# EAGLE design ROMmulti_final_rev01 (EAGLE 9.6.2)
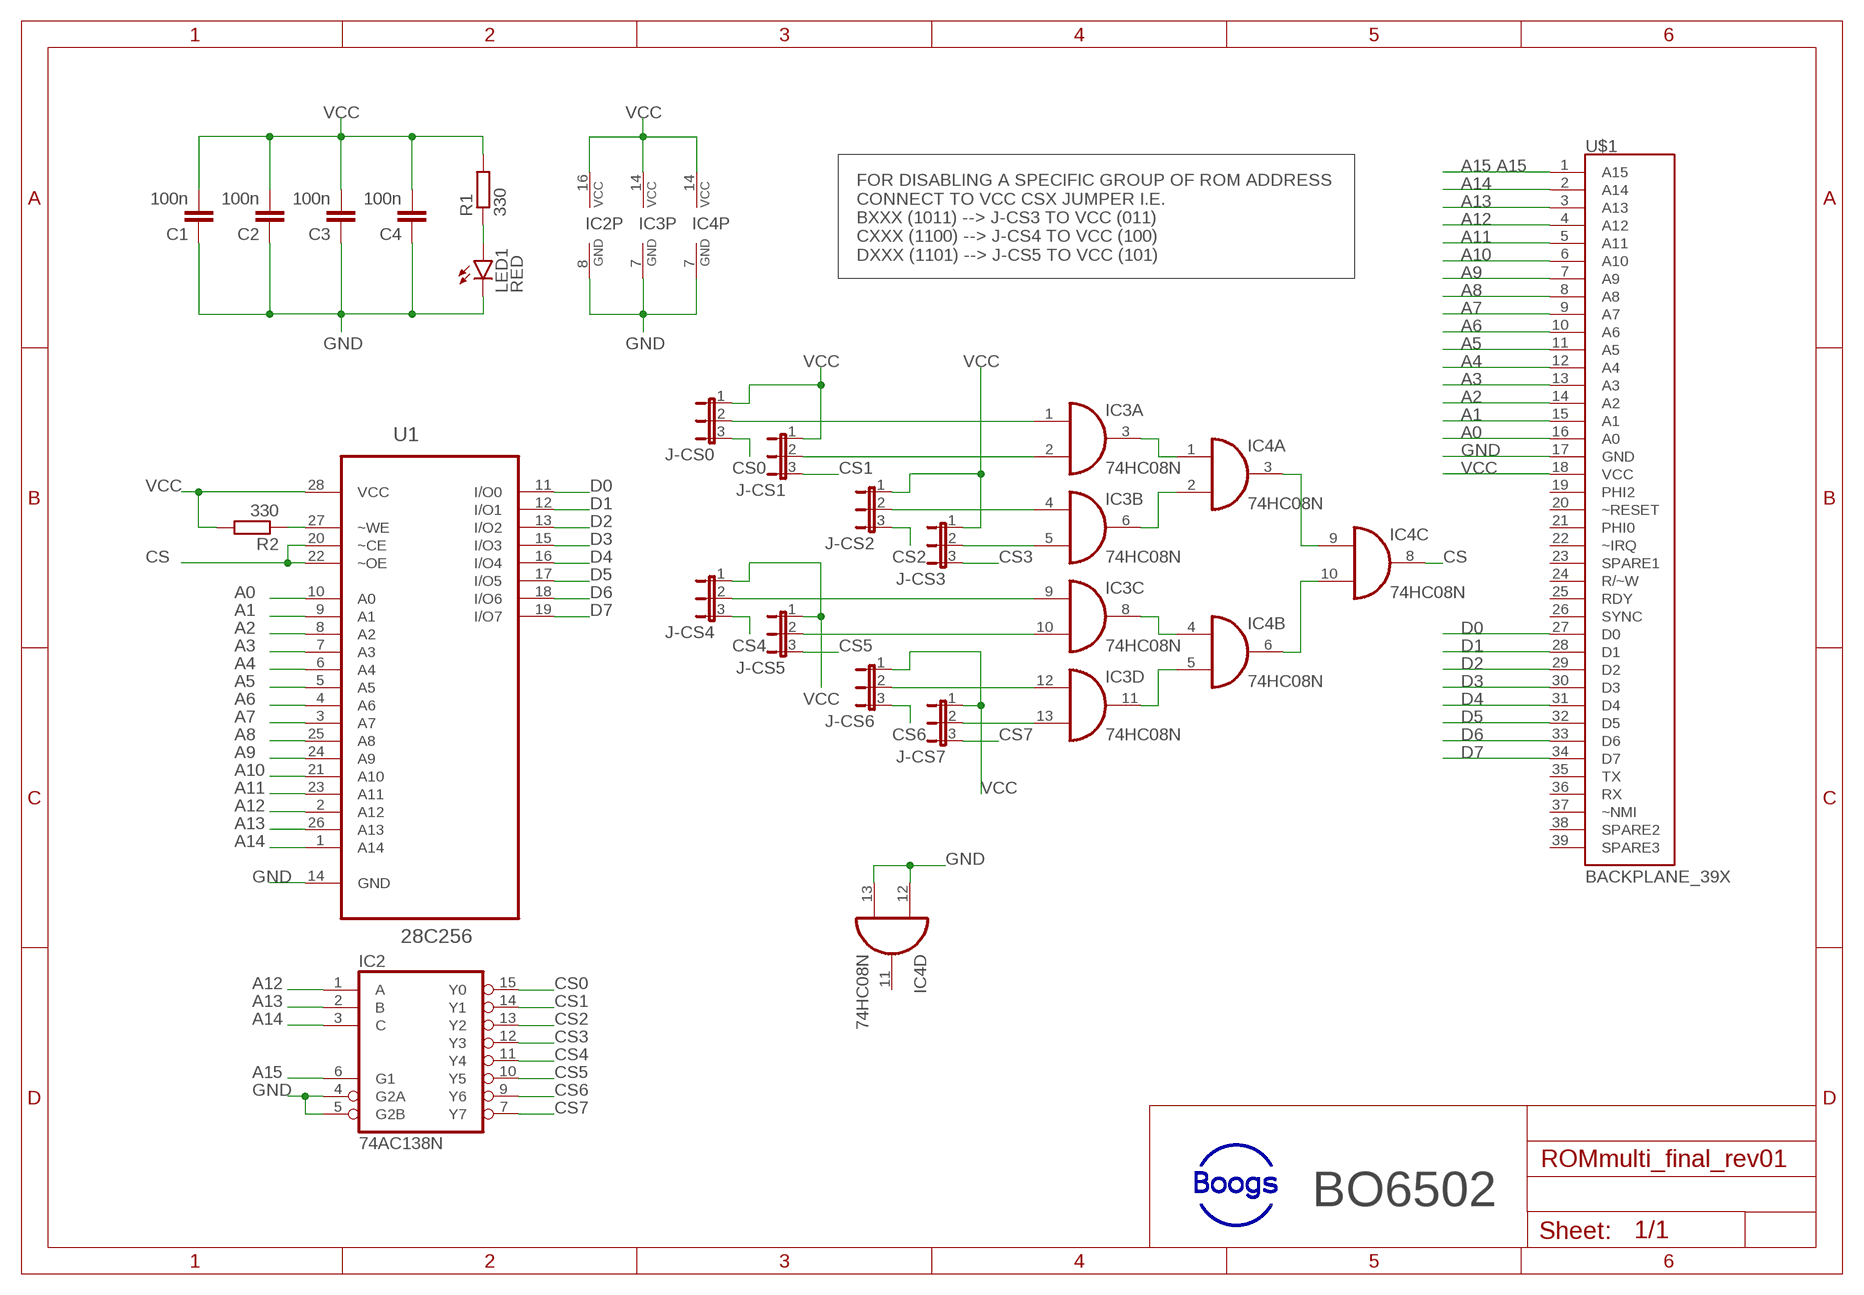
[diagram p0: schematic, sheet 1]

## Parts
C1  100n  C-EU025-025X050  [C025-025X050]
C2  100n  C-EU025-025X050  [C025-025X050]
C3  100n  C-EU025-025X050  [C025-025X050]
C4  100n  C-EU025-025X050  [C025-025X050]
IC2  74AC138N  [DIL16]
IC3  74HC08N  [DIL14]
IC4  74HC08N  [DIL14]
J-CS0  J-CS0  JP2E  [JP2]
J-CS1  J-CS1  JP2E  [JP2]
J-CS2  J-CS2  JP2E  [JP2]
J-CS3  J-CS3  JP2E  [JP2]
J-CS4  J-CS4  JP2E  [JP2]
J-CS5  J-CS5  JP2E  [JP2]
J-CS6  J-CS6  JP2E  [JP2]
J-CS7  J-CS7  JP2E  [JP2]
LED1  RED  LED5MM  [LED5MM]
R1  330  R-EU_0207/10  [0207/10]
R2  330  R-EU_0207/10  [0207/10]
U1  28C256  AT28C256-15PU  [DIP254P1524X482-28]
U$1  BACKPLANE_39X  [BP_39X]

## Nets
A0: U1.10(A0) U$1.16(A0)
A1: U1.9(A1) U$1.15(A1)
A2: U1.8(A2) U$1.14(A2)
A3: U1.7(A3) U$1.13(A3)
A4: U1.6(A4) U$1.12(A4)
A5: U1.5(A5) U$1.11(A5)
A6: U1.4(A6) U$1.10(A6)
A7: U1.3(A7) U$1.9(A7)
A8: U1.25(A8) U$1.8(A8)
A9: U1.24(A9) U$1.7(A9)
A10: U1.21(A10) U$1.6(A10)
A11: U1.23(A11) U$1.5(A11)
A12: IC2.1(A) U1.2(A12) U$1.4(A12)
A13: IC2.2(B) U1.26(A13) U$1.3(A13)
A14: IC2.3(C) U1.1(A14) U$1.2(A14)
A15: IC2.6(G1) U$1.1(A15)
CS: IC4.8(C:O) U1.20(~CE) U1.22(~OE)
CS0: IC2.15(Y0) J-CS0.3
CS1: IC2.14(Y1) J-CS1.3
CS2: IC2.13(Y2) J-CS2.3
CS3: IC2.12(Y3) J-CS3.3
CS4: IC2.11(Y4) J-CS4.3
CS5: IC2.10(Y5) J-CS5.3
CS6: IC2.9(Y6) J-CS6.3
CS7: IC2.7(Y7) J-CS7.3
D0: U1.11(I/O0) U$1.27(D0)
D1: U1.12(I/O1) U$1.28(D1)
D2: U1.13(I/O2) U$1.29(D2)
D3: U1.15(I/O3) U$1.30(D3)
D4: U1.16(I/O4) U$1.31(D4)
D5: U1.17(I/O5) U$1.32(D5)
D6: U1.18(I/O6) U$1.33(D6)
D7: U1.19(I/O7) U$1.34(D7)
GND: C1.1 C2.1 C3.1 C4.1 IC2.4(G2A) IC2.5(G2B) IC2.8(GND) IC3.7(P:GND) IC4.7(P:GND) IC4.12(D:I0) IC4.13(D:I1) LED1.K(C) U1.14(GND) U$1.17(GND)
N$1: R2.1 U1.27(~WE)
N$5: IC3.3(A:O) IC4.1(A:I0)
N$6: LED1.A R1.1
N$7: IC3.6(B:O) IC4.2(A:I1)
N$8: IC3.8(C:O) IC4.4(B:I0)
N$10: IC3.11(D:O) IC4.5(B:I1)
N$11: IC4.3(A:O) IC4.9(C:I0)
N$12: IC4.6(B:O) IC4.10(C:I1)
N$13: IC3.1(A:I0) J-CS0.2
N$14: IC3.2(A:I1) J-CS1.2
N$15: IC3.4(B:I0) J-CS2.2
N$16: IC3.5(B:I1) J-CS3.2
N$17: IC3.9(C:I0) J-CS4.2
N$18: IC3.10(C:I1) J-CS5.2
N$19: IC3.12(D:I0) J-CS6.2
N$20: IC3.13(D:I1) J-CS7.2
VCC: C1.2 C2.2 C3.2 C4.2 IC2.16(VCC) IC3.14(P:VCC) IC4.14(P:VCC) J-CS0.1 J-CS1.1 J-CS2.1 J-CS3.1 J-CS4.1 J-CS5.1 J-CS6.1 J-CS7.1 R1.2 R2.2 U1.28(VCC) U$1.18(VCC)
Unconnected: IC4.11(D:O) U$1.19(PHI2) U$1.20(~RESET) U$1.21(PHI0) U$1.22(~IRQ) U$1.23(SPARE1) U$1.24(R/~W) U$1.25(RDY) U$1.26(SYNC) U$1.35(TX) U$1.36(RX) U$1.37(~NMI) U$1.38(SPARE2) U$1.39(SPARE3)

## Notes on the sheet
- FOR DISABLING A SPECIFIC GROUP OF ROM ADDRESS
  CONNECT TO VCC CSX JUMPER I.E. 
  BXXX (1011) --> J-CS3 TO VCC (011)
  CXXX (1100) --> J-CS4 TO VCC (100)
  DXXX (1101) --> J-CS5 TO VCC (101)
- BO6502

## Library data of the parts
C1-C4 = rcl:C-EU: CAPACITOR, European symbol; SPICEPREFIX: C
IC2 = 74xx-eu:74*138: 3-line to 8-line DECODER/DEMULTIPLEXER
IC3 IC4 = 74xx-eu:74*08: Quad 2-input AND gate
J-CS0 J-CS1-J-CS7 = jumper:JP2E: JUMPER
LED1 = led:LED: LED OSRAM: - CHIPLED LG R971, LG N971, LY N971, LG Q971, LY Q971, LO R971, LY R971 LH N974, LH R974 LS Q976, LO Q976, LY Q976 LO Q996 - Hyper CHIPLED LW Q18S LB Q993, LB Q99A, LB R99A - SideLED LS A670, LO A670, LY A670, LG A670, LP A670 LB A673, LV A673, LT A673, LW A673 LH A674 LY A675 LS A676, LA A676, LO A676, LY A676, LW A676 LS A679, LY A679, LG A679 - Hyper Micro SIDELED® LS Y876, LA Y876, LO Y876, LY Y876 LT Y87S - SmartLED LW L88C, LW L88S LB L89C, LB L89S, LG L890 LS L89K, LO L89K, LY L89K LS L896, LA L896, LO L896, LY L896 - TOPLED LS T670, LO T670, LY T670, LG T670, LP T670 LSG T670, LSP T670, LSY T670, LOP T670, LYG T670 LG T671, LOG T671, LSG T671 LB T673, LV T673, LT T673, LW T673 LH T674 LS T676, LA T676, LO T676, LY T676, LB T676, LH T676, LSB T676, LW T676 LB T67C, LV T67C, LT T67C, LS T67K, LO T67K, LY T67K, LW E67C LS E67B, LA E67B, LO E67B, LY E67B, LB E67C, LV E67C, LT E67C LW T67C LS T679, LY T679, LG T679 LS T770, LO T770, LY T770, LG T770, LP T770 LB T773, LV T773, LT T773, LW T773 LH T774 LS E675, LA E675, LY E675, LS T675 LS T776, LA T776, LO T776, LY T776, LB T776 LHGB T686 LT T68C, LB T68C - Hyper Mini TOPLED® LB M676 - Mini TOPLED Santana® LG M470 LS M47K, LO M47K, LY M47K Source: http://www.osram.convergy.de LUXEON: - LUMILED® LXK2-PW12-R00, LXK2-PW12-S00, LXK2-PW14-U00, LXK2-PW14-V00 LXK2-PM12-R00, LXK2-PM12-S00, LXK2-PM14-U00 LXK2-PE12-Q00, LXK2-PE12-R00, LXK2-PE12-S00, LXK2-PE14-T00, LXK2-PE14-U00 LXK2-PB12-K00, LXK2-PB12-L00, LXK2-PB12-M00, LXK2-PB14-N00, LXK2-PB14-P00, LXK2-PB14-Q00 LXK2-PR12-L00, LXK2-PR12-M00, LXK2-PR14-Q00, LXK2-PR14-R00 LXK2-PD12-Q00, LXK2-PD12-R00, LXK2-PD12-S00 LXK2-PH12-R00, LXK2-PH12-S00 LXK2-PL12-P00, LXK2-PL12-Q00, LXK2-PL12-R00 Source: www.luxeon.com KINGBRIGHT: KA-3528ASYC Source: www.kingbright.com
R1 R2 = rcl:R-EU_: RESISTOR, European symbol; SPICEPREFIX: R
U1 = AT28C256-15PU:AT28C256-15PU: Paged Parallel EEPROM Check availability <https://pricing.snapeda.com/parts/AT28C256-15PU/Microchip/view-part?ref=eda>; AVAILABILITY: In Stock; CHECK_PRICES: https://www.snapeda.com/parts/AT28C256-15PU/Microchip/view-part/?ref=eda; DESCRIPTION: EEPROM Memory IC 256Kb (32K x 8) Parallel 150 ns 28-PDIP; MF: Microchip; MP: AT28C256-15PU; PACKAGE: DIP-28 Microchip; PRICE: None; PURCHASE-URL: https://www.snapeda.com/api/url_track_click_mouser/?unipart_id=1769426&manufacturer=Microchip&part_name=AT28C256-15PU&search_term=None; SNAPEDA_LINK: https://www.snapeda.com/parts/AT28C256-15PU/Microchip/view-part/?ref=snap
U$1 = 65xx_family:BACKPLANE_39X; A15: A15

## Board
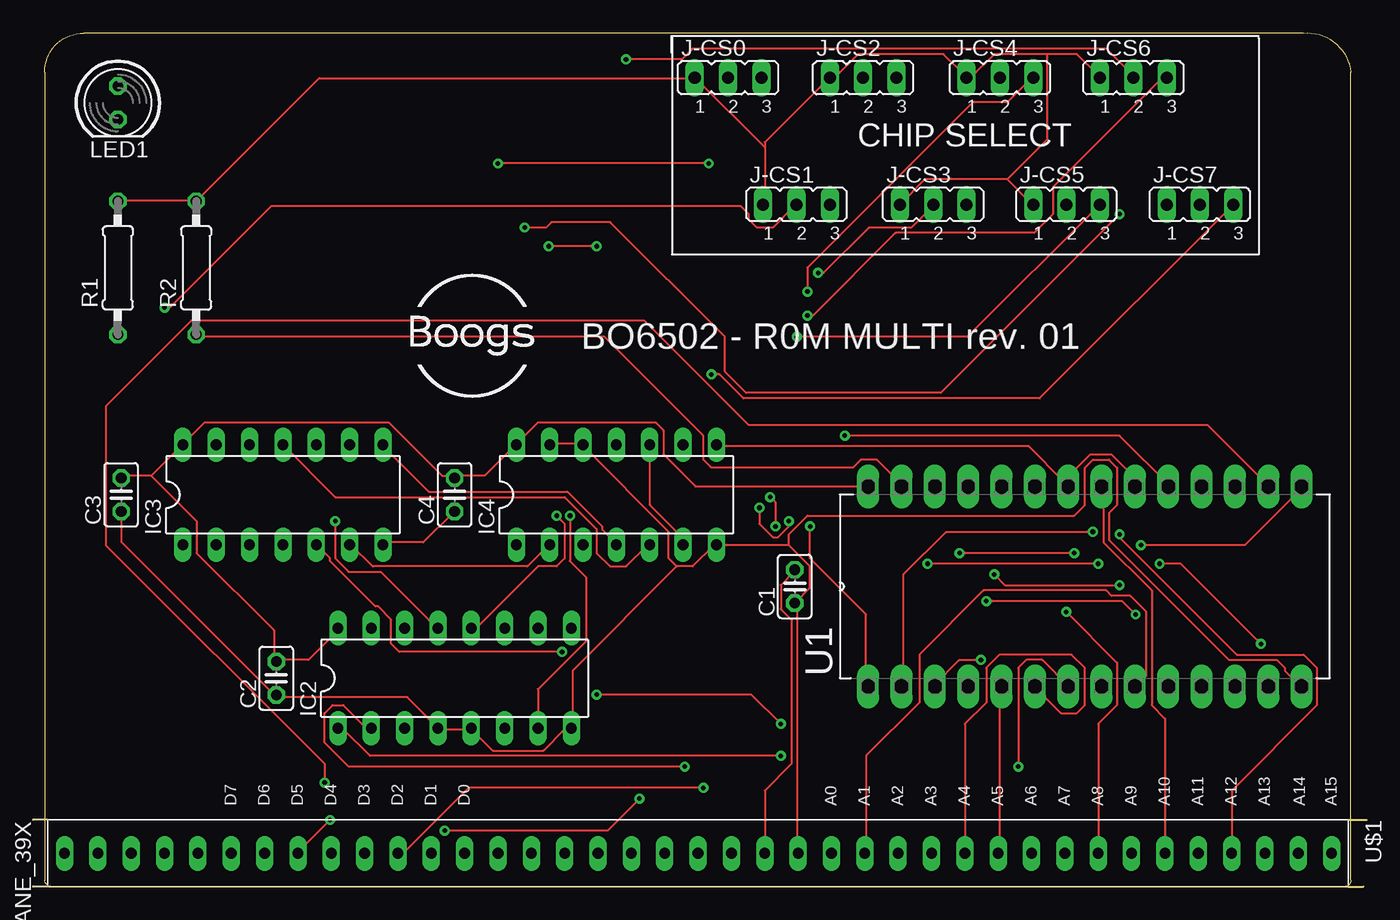
[diagram p1: board, top side]
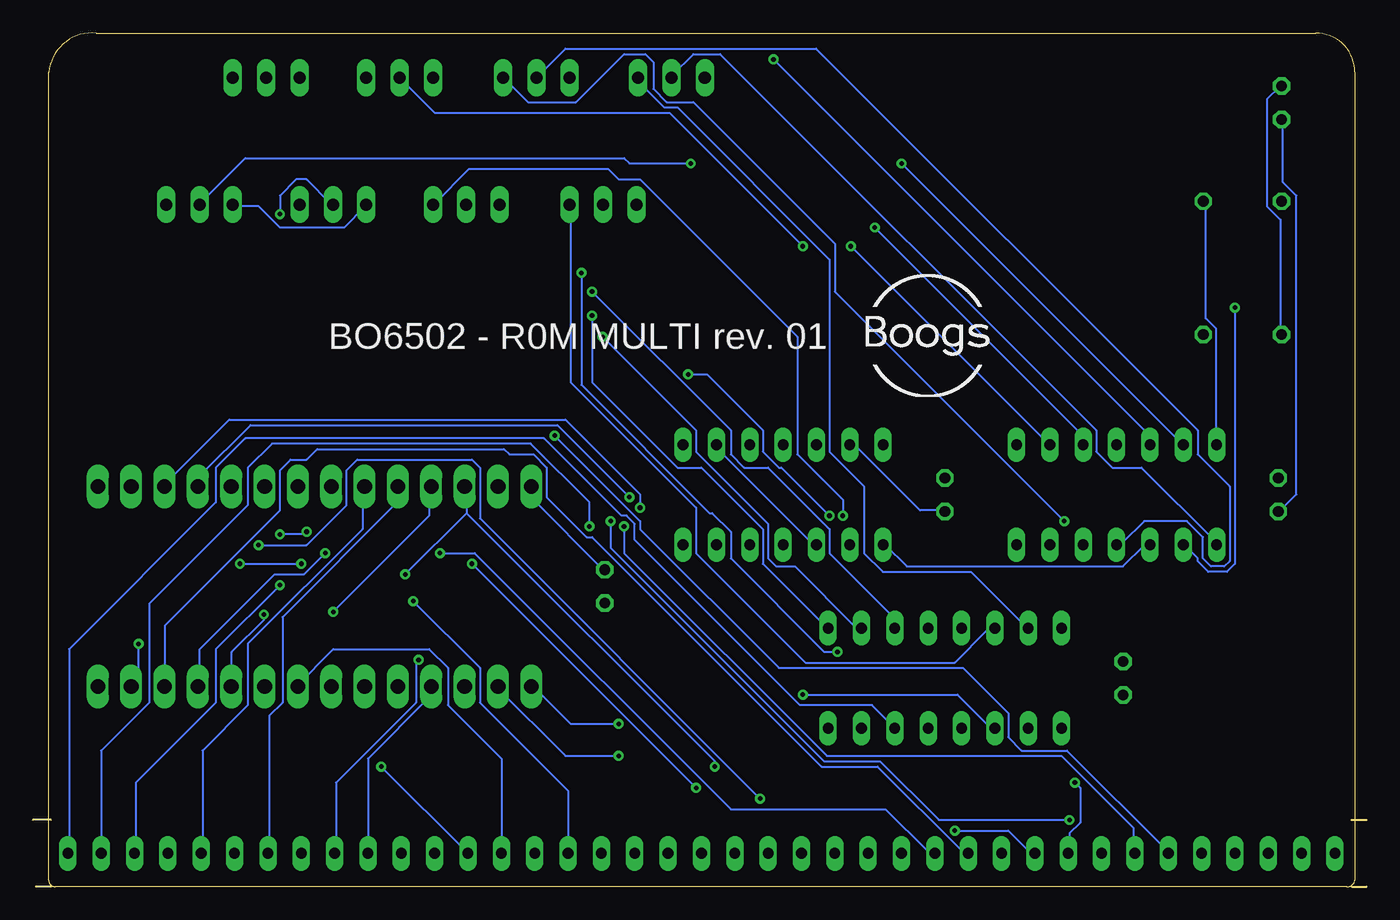
[diagram p2: board, bottom side, seen from below]

Size 101.6 x 65.02 mm. Coordinates in mm from the lower left corner, seen from the top.
Outline: 1.14,5.08 0,5.08
Outline: 1.14,0 0,0
Outline: 100.2,5.08 101.6,5.08
Outline: 100.2,0 101.35,0
Outline: 1.52,0 99.89,0 arc90 100.39,0.5 100.39,62 arc90 96.75,65 3.89,65 arc90 0.89,62 0.89,0.5 arc90 1.52,0
Copper layers (1*16): Top 0.035mm / dielectric 1.5mm / Bottom 0.035mm
Design rules "default *": minimum track width 6mil, minimum drill 0.35mm, track to track 10mil, track to pad 10mil, pad to pad 10mil, via to via 10mil, smd to smd 6mil, copper to edge 40mil, drill to drill 6mil, minimum pad ring 10mil, minimum via ring 8mil, stop-mask expansion 4mil, vias tented up to drill 15mil, thermal gap 10mil

### Footprints (pad centres in the part's own frame; a part is rotated, then mirrored left to right if it is on the bottom)
C025-025X050 = drill 0.813 octagon: 1 -1.27,0; 2 1.27,0
DIL16 = drill 0.813 long: 1 -8.89,-3.81; 2 -6.35,-3.81; 3 -3.81,-3.81; 4 -1.27,-3.81; 5 1.27,-3.81; 6 3.81,-3.81; 7 6.35,-3.81; 8 8.89,-3.81; 9 8.89,3.81; 10 6.35,3.81; 11 3.81,3.81; 12 1.27,3.81; 13 -1.27,3.81; 14 -3.81,3.81; 15 -6.35,3.81; 16 -8.89,3.81
DIL14 = drill 0.813 long: 1 -7.62,-3.81; 2 -5.08,-3.81; 3 -2.54,-3.81; 4 0,-3.81; 5 2.54,-3.81; 6 5.08,-3.81; 7 7.62,-3.81; 8 7.62,3.81; 9 5.08,3.81; 10 2.54,3.81; 11 0,3.81; 12 -2.54,3.81; 13 -5.08,3.81; 14 -7.62,3.81
JP2 = drill 0.914 long: 1 -2.54,0; 2 0,0; 3 2.54,0
LED5MM = drill 0.813 octagon: A -1.27,0; K 1.27,0
0207/10 = drill 0.813 octagon: 1 -5.08,0; 2 5.08,0
DIP254P1524X482-28 = drill 1.118 long: 1 -15.24,33.02; 2 -15.24,30.48; 3 -15.24,27.94; 4 -15.24,25.4; 5 -15.24,22.86; 6 -15.24,20.32; 7 -15.24,17.78; 8 -15.24,15.24; 9 -15.24,12.7; 10 -15.24,10.16; 11 -15.24,7.62; 12 -15.24,5.08; 13 -15.24,2.54; 14 -15.24,0; 15 0,0; 16 0,2.54; 17 0,5.08; 18 0,7.62; 19 0,10.16; 20 0,12.7; 21 0,15.24; 22 0,17.78; 23 0,20.32; 24 0,22.86; 25 0,25.4; 26 0,27.94; 27 0,30.48; 28 0,33.02
BP_39X = drill 0.813 long: 1 1.27,59.69; 2 1.27,57.15; 3 1.27,54.61; 4 1.27,52.07; 5 1.27,49.53; 6 1.27,46.99; 7 1.27,44.45; 8 1.27,41.91; 9 1.27,39.37; 10 1.27,36.83; 11 1.27,34.29; 12 1.27,31.75; 13 1.27,29.21; 14 1.27,26.67; 15 1.27,24.13; 16 1.27,21.59; 17 1.27,19.05; 18 1.27,16.51; 19 1.27,13.97; 20 1.27,11.43; 21 1.27,8.89; 22 1.27,6.35; 23 1.27,3.81; 24 1.27,1.27; 25 1.27,-1.27; 26 1.27,-3.81; 27 1.27,-6.35; 28 1.27,-8.89; 29 1.27,-11.43; 30 1.27,-13.97; 31 1.27,-16.51; 32 1.27,-19.05; 33 1.27,-21.59; 34 1.27,-24.13; 35 1.27,-26.67; 36 1.27,-29.21; 37 1.27,-31.75; 38 1.27,-34.29; 39 1.27,-36.83

### Placement (x,y rotation side)
C1  58.04,22.86 90 top
C2  18.54,15.88 90 top
C3  6.73,29.85 90 top
C4  32.13,29.85 90 top
IC2  32.13,15.88 0 top
IC3  19.05,29.85 0 top
IC4  44.45,29.85 0 top
J-CS0  52.96,61.6 0 top
J-CS1  58.17,51.95 0 top
J-CS2  63.25,61.6 0 top
J-CS3  68.58,51.95 0 top
J-CS4  73.66,61.6 0 top
J-CS5  78.74,51.95 0 top
J-CS6  83.82,61.6 0 top
J-CS7  88.9,51.95 0 top
LED1  6.48,59.69 270 top
R1  6.48,47.12 90 top
R2  12.45,47.12 90 top
U1  96.65,30.48 90 top
U$1  39.24,3.81 270 top

### Tracks (layer width: path | path; a pad name or v marks a point on that pad's centre or on a via)
A0  (via drill 0.35)
  Top 0.152: v72.62,21.75 82.98,21.75 v84,20.73
  Bottom 0.152: U$1.16 60.83,7.32 67.54,14.02 67.54,16.67 v72.62,21.75 | v84,20.73 84,20.32 86.44,17.89 86.44,15.24 U1.10
A1
  Top 0.152: U$1.15 63.48,2.65 63.48,9.96 67.54,14.02 67.54,17.68 72.41,22.56 81.76,22.56 82.17,22.15 83.59,22.15 84.81,20.93 84.81,16.06 84,15.24 U1.9
A2
  Bottom 0.152: U$1.14 65.91,9.76 69.98,13.82 69.98,16.67 71.4,18.09 78.71,18.09 81.56,15.24 U1.8
A3  (via drill 0.35)
  Top 0.152: v75.06,9.15 75.06,16.67 75.67,17.28 76.89,17.28 78.92,15.24 U1.7
  Bottom 0.152: v75.06,9.15 U$1.13
A4
  Top 0.152: U$1.12 70.99,12.4 72.62,14.02 72.62,16.67 73.63,17.68 79.12,17.68 80.14,16.67 80.14,13.82 79.53,13.21 78.31,13.21 76.28,15.24 U1.6
A5
  Top 0.152: U$1.11 73.63,2.65 73.63,15.24 U1.5
A6
  Bottom 0.152: U$1.10 76.07,9.76 71.4,14.43 71.4,15.24 U1.4
A7  (via drill 0.35)
  Top 0.152: v72.21,17.28 70.59,17.28 68.55,15.24 U1.3
  Bottom 0.152: v72.21,17.28 72.41,17.07 72.41,14.02 78.51,7.93 78.51,2.65 U$1.9
A8  (via drill 0.35)
  Top 0.152: U$1.8 81.15,12.4 82.58,13.82 82.58,17.07 v78.71,20.93
  Bottom 0.152: v78.71,20.93 71.4,28.25 71.4,30.48 U1.25
A9
  Bottom 0.152: U$1.7 83.59,2.65 83.59,13.01 82.58,14.02 82.58,20.53 73.84,29.26 73.84,30.48 U1.24
A10
  Top 0.152: U$1.6 86.23,12.81 85.22,13.82 85.22,22.56 81.56,26.22 81.56,30.48 U1.21
A11
  Bottom 0.152: U$1.5 88.67,2.65 88.67,10.37 85.22,13.82 85.22,18.49 76.48,27.23 76.48,30.48 U1.23
A12  (via drill 0.35)
  Top 0.152: v56.97,9.96 25.68,9.96 23.65,11.99 23.24,11.99 IC2.1 | U$1.4 91.31,7.32 97.81,13.82 97.81,16.67 96.8,17.68 91.72,17.68 82.78,26.62 v82.78,26.83 | v80.75,27.03 69.57,27.03 66.32,23.78 66.32,15.24 U1.2
  Bottom 0.152: v56.97,9.96 61.04,9.96 66.32,15.24 U1.2 | v82.78,26.83 80.95,26.83 v80.75,27.03
A13  (via drill 0.35)
  Top 0.152: v49.66,9.15 24.05,9.15 22.22,10.98 22.22,13.21 22.84,13.82 23.65,13.82 25.27,12.2 25.68,12.2 IC2.2 | v82.78,22.97 74.04,22.97 v73.23,23.78
  Bottom 0.152: v49.66,9.15 49.66,9.55 68.55,28.45 | 68.55,28.45 68.55,30.48 U1.26 | v82.78,22.97 87.66,18.09 87.66,14.02 93.75,7.93 93.75,2.65 U$1.3 | 68.55,28.45 v73.23,23.78
A14  (via drill 0.35)
  Top 0.152: v42.95,14.63 54.74,14.63 v56.97,12.4 | v59.21,27.44 59.21,25 63.48,20.73 63.48,15.24 U1.1
  Bottom 0.152: v42.95,14.63 31.17,14.63 28.73,12.2 28.32,12.2 IC2.3 | v56.97,12.4 60.63,12.4 63.48,15.24 U1.1 | U$1.2 96.39,10.37 92.73,14.02 92.73,21.54 85.22,29.06 85.22,31.91 83.39,33.73 63.68,33.73 59.21,29.26 v59.21,27.44
A15
  Bottom 0.152: U$1.1 98.83,2.65 98.83,18.09 87.66,29.26 87.66,31.91 85.42,34.14 62.66,34.14 56.77,28.25 56.36,28.25 55.75,27.64 55.75,26.42 43.16,13.82 37.67,13.82 36.04,12.2 IC2.6
CS
  Top 0.152: 78.51,30.89 78.92,30.48 U1.22 78.51,30.89 | 78.51,30.89 75.87,33.53 52.1,33.53 IC4.8 | 78.51,30.89 80.54,32.92 82.17,32.92 83.8,31.3 83.8,30.48 U1.20
CS0
  Bottom 0.152: IC2.15 25.88,19.71 30.15,23.98 36.86,23.98 38.28,25.4 38.28,30.48 40.92,33.13 40.92,47.76 52.5,59.34 53.52,59.34 55.35,61.17 55.35,61.57 J-CS0.3
CS1
  Bottom 0.152: IC2.14 28.32,19.51 28.93,19.51 31.37,17.07 42.75,17.07 51.08,25.4 51.08,28.86 60.63,38.41 60.63,51.82 J-CS1.3
CS2  (via drill 0.35)
  Top 0.152: v23.04,27.84 23.04,25 24.05,23.98 26.49,23.98 30.76,19.71 IC2.13
  Bottom 0.152: v23.04,27.84 40.51,45.32 40.51,48.97 51.28,59.74 53.32,59.74 54.33,60.76 54.33,62.79 54.94,63.4 56.57,63.4 60.22,59.74 63.88,59.74 65.71,61.57 J-CS2.3
CS3  (via drill 0.35)
  Top 0.152: v39.9,28.25 40.51,27.64 40.51,25 39.9,24.39 38.48,24.39 33.81,19.71 33.4,19.71 IC2.12
  Bottom 0.152: v39.9,28.25 39.9,29.47 43.36,32.92 43.36,41.86 55.35,53.85 56.97,53.85 57.79,54.66 68.35,54.66 70.99,52.02 J-CS3.3
CS4  (via drill 0.35)
  Top 0.152: v59,45.32 59,47.15 71.6,59.74 74.24,59.74 76.07,61.57 J-CS4.3
  Bottom 0.152: v59,45.32 48.44,34.75 48.44,32.92 47.42,31.91 45.59,31.91 40.92,27.23 40.92,25.4 36.04,20.53 36.04,19.71 IC2.11
CS5  (via drill 0.35)
  Top 0.152: v58.19,41.86 71.2,41.86 J-CS5.3
  Bottom 0.152: v58.19,41.86 51.08,34.75 51.08,33.13 45.59,27.64 45.59,25 44.98,24.39 43.56,24.39 38.89,19.71 38.48,19.71 IC2.10
CS6  (via drill 0.35)
  Top 0.152: v59,43.49 59.41,43.49 65.71,49.79 76.28,49.79 77.7,51.21 77.7,53.24 86.23,61.78 J-CS6.3
  Bottom 0.152: v59,43.49 59,38.41 52.5,31.91 50.67,31.91 46,27.23 46,24.59 41.12,19.71 IC2.9
CS7  (via drill 0.35)
  Top 0.152: IC2.7 38.48,15.04 42.14,18.7 42.14,23.57 40.92,24.79 v40.92,28.25 | v51.69,39.02 52.3,39.02 54.13,37.19 76.68,37.19 J-CS7.3
  Bottom 0.152: v40.92,28.25 44.58,31.91 44.78,31.91 46,33.13 46,34.75 50.27,39.02 v51.69,39.02
D0  (via drill 0.35)
  Top 0.152: v79.32,25.4 v70.59,25.4
  Bottom 0.152: v70.59,25.4 67.94,25.4 48.44,5.9 36.65,5.9 33.4,2.65 33,2.65 U$1.27 | v79.32,25.4 80.95,23.78 83.19,23.78 88.88,18.09 88.88,15.24 U1.11
D1
  Bottom 0.152: U$1.28 30.35,2.65 30.76,2.65 37.26,9.15 41.53,9.15 59,26.62 59.41,26.62 62.46,29.67 62.46,31.91 63.48,32.92 65.3,32.92 65.71,33.33 79.93,33.33 80.75,32.52 81.97,32.52 82.78,31.7 82.78,28.65 91.52,19.92 91.52,15.24 U1.12
D2  (via drill 0.35)
  Top 0.152: v51.08,7.52 33.2,7.52 28.32,2.65 27.91,2.65 U$1.29 | v81.15,24.59 v68.15,24.59 | v85.83,24.59 87.45,24.59 v93.55,18.49
  Bottom 0.152: v68.15,24.59 v51.08,7.52 | v85.83,24.59 v81.15,24.59 | v93.55,18.49 93.55,15.65 93.95,15.24 U1.13
D3  (via drill 0.35)
  Top 0.152: v31.37,4.27 43.76,4.27 v46.2,6.71 | v84.4,26.01 92.33,26.01 96.8,30.48 U1.15
  Bottom 0.152: v31.37,4.27 27.3,4.27 25.68,2.65 25.27,2.65 U$1.30 | v46.2,6.71 67.54,28.05 67.54,31.91 68.15,32.52 76.89,32.52 77.7,31.7 77.7,29.06 80.75,26.01 v84.4,26.01
D4  (via drill 0.35)
  Top 0.152: v22.22,7.93 22.22,9.35 5.56,26.01 5.56,36.58 12.06,43.08 46.61,43.08 54.53,35.16 89.48,35.16 94.16,30.48 U1.16
  Bottom 0.152: v22.22,7.93 21.82,7.52 21.82,4.88 22.63,4.07 22.63,2.65 U$1.31
D5  (via drill 0.35)
  Top 0.152: v22.63,5.08 20.19,2.65 U$1.32 | v57.58,27.84 57.58,27.44 56.77,26.62 56.36,26.62 55.35,27.64 v55.35,28.86
  Bottom 0.152: v22.63,5.08 32.59,5.08 37.06,9.55 41.33,9.55 57.58,25.81 v57.58,27.84 | v55.35,28.86 55.35,29.87 61.04,35.56 86.64,35.56 91.72,30.48 U1.17
D6  (via drill 0.35)
  Top 0.152: v56.57,27.44 56.57,29.26 v56.16,29.67
  Bottom 0.152: v56.57,27.44 56.57,25.4 41.12,9.96 23.24,9.96 17.75,4.47 17.75,2.65 U$1.33 | v56.16,29.67 61.65,35.16 85.01,35.16 88.88,31.3 88.88,30.48 U1.18
D7  (via drill 0.35)
  Top 0.152: v61.85,34.34 82.78,34.34 86.64,30.48 U1.19
  Bottom 0.152: v61.85,34.34 55.35,27.84 55.35,27.23 44.78,16.67 30.76,16.67 27.3,13.21 27.3,11.38 26.29,10.37 22.84,10.37 15.11,2.65 U$1.34
GND
  Top 0.152: 33.4,11.99 30.96,11.99 IC2.4 30.76,12.2 28.52,14.43 18.57,14.43 C2.1 18.36,14.63 6.78,26.22 6.78,28.45 C3.1 | 33.4,11.99 35.03,10.37 38.89,10.37 40.51,11.99 40.92,11.99 IC2.8 41.12,12.2 41.12,16.46 49.05,24.39 | 33.4,11.99 IC2.5 | IC4.13 39.5,33.73 41.73,33.73 IC4.12 41.94,33.53 48.44,27.03 48.44,25 49.05,24.39 | IC3.7 26.7,26.22 29.74,26.22 31.98,28.45 C4.1 | U$1.17 58.19,2.65 58.19,21.54 C1.1 59.21,22.76 59.21,24.39 57.58,26.01 | 57.58,26.01 52.1,26.01 IC4.7 51.89,26.01 50.27,24.39 49.05,24.39 | 57.58,26.01 57.58,26.83 59,28.25 79.32,28.25 80.14,29.06 80.14,31.91 80.75,32.52 81.97,32.52 82.58,31.91 82.58,29.06 81.97,28.45 81.97,26.42 91.11,17.28 94.77,17.28 95.38,16.67 95.38,16.46 96.6,15.24 U1.14
  Bottom 0.152: LED1.K 6.38,58.32 6.38,53.65 5.36,52.63 5.36,29.87 6.58,28.65 C3.1 | IC4.13 39.29,33.53 38.89,33.53 34.01,28.65 32.18,28.65 C4.1
N$1
  Top 0.152: R2.1 12.47,41.86 43.56,41.86 51.08,34.34 51.08,32.52 51.69,31.91 62.46,31.91 63.07,32.52 64.29,32.52 66.32,30.48 U1.27
N$5
  Bottom 0.152: IC3.3 16.54,26.01 16.94,26.01 18.57,24.39 35.03,24.39 36.65,26.01 IC4.1
N$6
  Bottom 0.152: R1.1 6.58,42.07 6.58,50.8 7.6,51.82 7.6,59.95 6.58,60.96 LED1.A
N$7
  Top 0.152: IC3.6 24.26,26.01 25.88,24.39 37.67,24.39 39.29,26.01 IC4.2
N$8
  Top 0.152: IC4.4 44.37,26.22 43.36,27.23 43.36,27.44 40.72,30.08 30.15,30.08 26.7,33.53 IC3.8
N$10
  Top 0.152: IC3.11 23.04,29.67 40.51,29.67 42.95,27.23 42.95,25.4 43.97,24.39 45.19,24.39 46.81,26.01 IC4.5
N$11
  Bottom 0.152: IC4.3 41.94,26.22 42.34,26.22 49.66,33.53 IC4.9
N$12
  Top 0.152: IC4.10 47.02,33.53 47.02,29.06 49.45,26.62 49.45,26.22 IC4.6
N$13
  Bottom 0.152: IC3.1 11.46,26.22 17.14,31.91 19.38,31.91 20.6,33.13 20.6,34.75 49.25,63.4 51.28,63.4 52.91,61.78 J-CS0.2
N$14  (via drill 0.35)
  Top 0.152: v10.03,44.1 10.44,44.1 18.16,51.82 53.92,51.82 54.53,51.21 54.53,50.8 55.14,50.19 56.36,50.19 57.99,51.82 J-CS1.2
  Bottom 0.152: v10.03,44.1 10.03,24.59 10.64,23.98 12.06,23.98 12.88,24.79 12.88,25 13.89,26.01 IC3.2
N$15
  Bottom 0.152: J-CS2.2 61.04,63.81 41.94,63.81 12.88,34.75 12.88,32.92 10.44,30.48 10.44,24.79 10.85,24.39 11.86,24.39 12.47,25 12.47,26.62 13.69,27.84 16.94,27.84 18.57,26.22 18.97,26.22 IC3.4
N$16  (via drill 0.35)
  Top 0.152: IC3.5 22.63,25 22.63,24.79 26.09,21.34 26.29,21.34 27.3,20.32 27.3,18.49 27.91,17.89 v40.31,17.89 | v59.82,46.74 60.22,46.74 63.68,50.19 66.93,50.19 68.55,51.82 J-CS3.2
  Bottom 0.152: v40.31,17.89 41.33,17.89 48.44,25 48.44,27.03 49.86,28.45 50.06,28.45 59.82,38.21 v59.82,46.74
N$17  (via drill 0.35)
  Top 0.152: v42.95,48.77 v39.29,48.77
  Bottom 0.152: v39.29,48.77 24.26,33.73 IC3.9 | v42.95,48.77 53.11,58.93 70.99,58.93 J-CS4.2
N$18  (via drill 0.35)
  Top 0.152: v37.47,50.19 39.09,50.19 39.5,50.6 43.97,50.6 52.71,41.86 52.71,39.22 54.33,37.6 69.16,37.6 v82.78,51.21
  Bottom 0.152: v37.47,50.19 21.61,34.34 21.61,33.73 IC3.10 | v82.78,51.21 82.78,52.63 81.56,53.85 80.75,53.85 78.92,52.02 J-CS5.2
N$19  (via drill 0.35)
  Top 0.152: v45.19,63 49.45,63 50.27,63.81 81.76,63.81 83.8,61.78 J-CS6.2
  Bottom 0.152: v45.19,63 16.54,34.34 16.54,33.73 IC3.12
N$20  (via drill 0.35)
  Top 0.152: v51.49,55.07 v35.43,55.07
  Bottom 0.152: v35.43,55.07 14.1,33.73 IC3.13 | v51.49,55.07 56.16,55.07 56.57,55.48 85.42,55.48 88.88,52.02 J-CS7.2
VCC
  Top 0.152: 55.75,56.29 55.75,56.7 60.63,61.57 J-CS2.1 60.83,61.78 61.24,61.78 62.87,63.4 69.37,63.4 70.99,61.78 J-CS4.1 71.2,61.78 71.6,61.78 73.23,63.4 77.29,63.4 | 55.75,56.29 55.75,52.02 J-CS1.1 | 55.75,56.29 50.47,61.57 J-CS0.1 50.27,61.57 21.82,61.57 R2.2 12.27,52.23 6.58,52.23 R1.2 | 77.29,63.4 79.53,63.4 81.15,61.78 J-CS6.1 | J-CS3.1 67.94,53.85 74.24,53.85 | 74.24,53.85 76.07,52.02 J-CS5.1 | 77.29,63.4 77.29,56.9 74.24,53.85 | U$1.18 55.75,7.32 57.79,9.35 57.79,20.32 56.97,21.14 56.97,22.97 57.99,23.98 C1.2 | IC2.16 23.24,19.51 21.01,17.28 18.57,17.28 C2.2 18.36,17.28 18.36,19.51 12.47,25.4 12.47,27.84 9.02,31.3 | 9.02,31.3 6.78,31.3 C3.2 | 9.02,31.3 11.25,33.53 IC3.14 11.46,33.73 13.08,35.36 27.1,35.36 31.17,31.3 31.98,31.3 C4.2 32.18,31.3 34.42,31.3 36.65,33.53 IC4.14 36.86,33.73 38.48,35.36 47.42,35.36 48.03,34.75 48.03,32.92 50.47,30.48 U1.28
  Bottom 0.152: J-CS7.1 86.23,51.82 84.4,51.82 82.78,50.19 77.9,50.19 76.28,51.82 J-CS5.1 | U1.28 63.48,30.48 63.48,29.47 58.19,24.18 C1.2 | R2.2 12.27,52.02 12.27,43.29 11.46,42.47 11.46,33.73 IC3.14

### Text on the board
tNames: CHIP SELECT | BO6502 - R0M MULTI rev. 01 | D7 | D6 | D5 | D4 | D3 | D2 | D1 | D0 | A0 | A1 | A2 | A3 | A4 | A5 | A6 | A7 | A8 | A9 | A10 | A11 | A12 | A13 | A14 | A15
bNames: BO6502 - R0M MULTI rev. 01